# EasyEDA schematic 1-Schematic_TW4 Main board2.json
TITLE: Sheet_1; REV: 1.0; Date: 2025-03-01; Sheet: 1/1; Drawn By: anthony.a.douglas; Company: Your Company
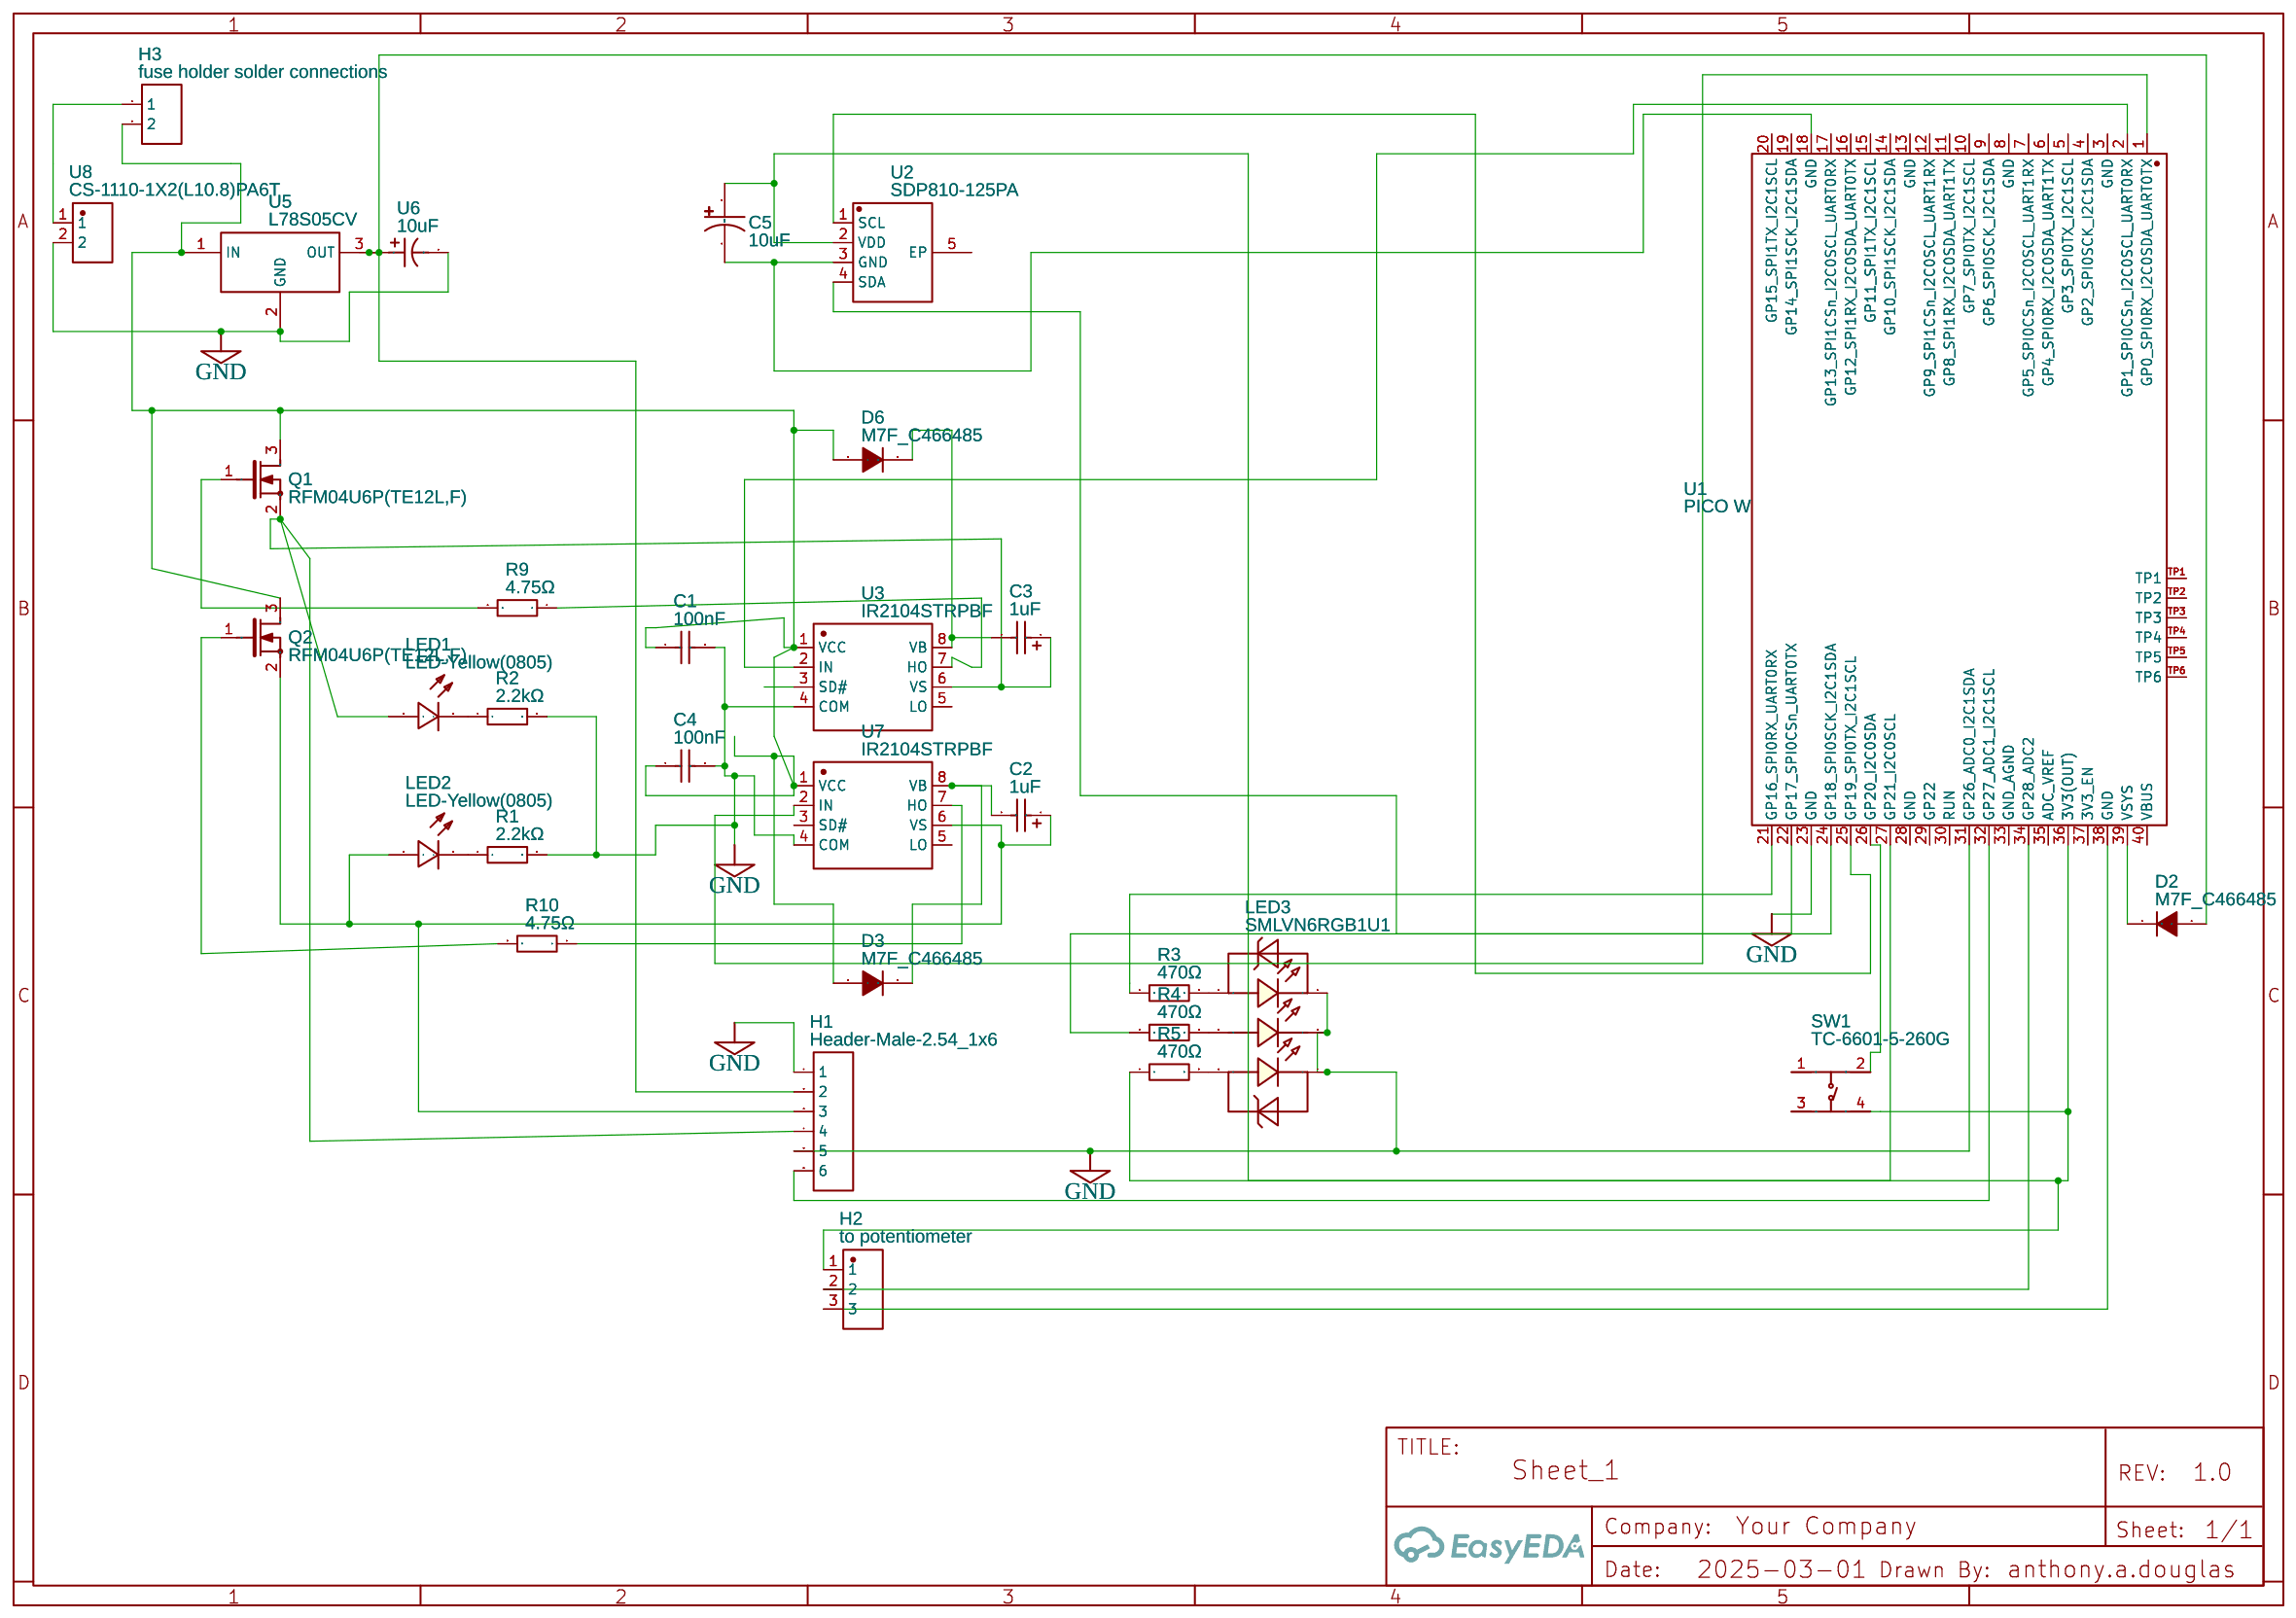
[diagram p0: schematic sheet]

## Parts
C1  100nF  [C0603]
C2  1uF  [CASE-A_3216]
C3  1uF  [CASE-A_3216]
C4  100nF  [C0603]
C5  10uF  [CAP-SMD_BD5.0-L5.3-W5.3-FD]
D2  M7F_C466485  [SMAF_L3.5-W2.6-LS4.7-RD]
D3  M7F_C466485  [SMAF_L3.5-W2.6-LS4.7-RD]
D6  M7F_C466485  [SMAF_L3.5-W2.6-LS4.7-RD]
H1  Header-Male-2.54_1x6  [HDR-TH_6P-P2.54-V-M-1]
H2  to potentiometer  [HDR-TH_3P-P2.54_HC-PM254-8.5H-1X3PW]
H3  fuse holder solder connections  [HDR-F-2.54_1X2]
LED1  LED-Yellow(0805)  [LED-0805]
LED2  LED-Yellow(0805)  [LED-0805]
LED3  SMLVN6RGB1U1  [LED-SMD_6P-L3.1-W2.8-BR_SMLVN6RGB]
Q1  RFM04U6P(TE12L,F)  [SC-62-3_L4.6-W2.5-P1.50-LS4.2-BR]
Q2  RFM04U6P(TE12L,F)  [SC-62-3_L4.6-W2.5-P1.50-LS4.2-BR]
R1  2.2kΩ  [R0603]
R2  2.2kΩ  [R0603]
R3  470Ω  [R1206]
R4  470Ω  [R1206]
R5  470Ω  [R1206]
R9  4.75Ω  [R0402]
R10  4.75Ω  [R0402]
SW1  TC-6601-5-260G  [KEY-SMD_4P-L6.0-W6.0-P4.50-LS10.0]
U1  PICO W  [COMM-SMD_L51.0-W21.0-P2.54_PICOW]
U2  SDP810-125PA  [SENSOR-TH_SDP810-125PA]
U3  IR2104STRPBF  [SOIC-8_L4.9-W3.9-P1.27-LS6.0-BL]
U5  L78S05CV  [TO-220-3_L10.0-W4.5-P2.54-L]
U6  10uF  [CAP-SMD_L2.0-W1.3-FD]
U7  IR2104STRPBF  [SOIC-8_L4.9-W3.9-P1.27-LS6.0-BL]
U8  CS-1110-1X2(L10.8)PA6T  [CONN-TH_CS-1110-1X2-PA6T]

## Library data of the parts
C1 C4 = CGA3E2X7R1H104KT0Y0N: Supplier: LCSC; Manufacturer: TDK; Supplier Part: C76711; JLCPCB Part Class: Extended Part
C2 C3 = TAJA105K035RNJ: Supplier: LCSC; Manufacturer: Kyocera AVX; Supplier Part: C7176; JLCPCB Part Class: Extended Part
C5 = EEEFK1V100AR: Contributor: LCSC; Supplier: LCSC; Supplier Part: C264057; Manufacturer: PANASONIC(松下); JLCPCB Part Class: Extended Part
D2 D3 D6 = M7F_C466485: Contributor: LCSC; Supplier: LCSC; Supplier Part: C466485; Manufacturer: High Diode(海德); Manufacturer Part: M7F; JLCPCB Part Class: Extended Part
H1 = Header-Male-2.54_1x6: Supplier: LCSC; Manufacturer: BOOMELE(博穆精密); Manufacturer Part: 2.54-1x6P直针; Supplier Part: C37208; JLCPCB Part Class: Extended Part
H2 = HC-PM254-8.5H-1X3PW: Supplier: LCSC; Supplier Part: C22373927; Manufacturer: HC(虹成电子); Manufacturer Part: HC-PM254-8.5H-1x3PW-02A; JLCPCB Part Class: Extended Part; Contributor: lcsc
H3 = HDR-F-2.54_1x2: Supplier Part: C49661; Supplier: LCSC; Contributor: LCEDA_Lib
LED1 LED2 = LED-Yellow(0805): Supplier: LCSC; Manufacturer: Hubei KENTO Elec; Manufacturer Part: 17-21SUYC/TR8; Supplier Part: C2296
LED3 = SMLVN6RGB1U1: Contributor: LCSC; Supplier: LCSC; Supplier Part: C2909770; Manufacturer: ROHM(罗姆); JLCPCB Part Class: Extended Part
Q1 Q2 = RFM04U6P(TE12L,F): Contributor: LCSC; Supplier: LCSC; Supplier Part: C194959; Manufacturer: TOSHIBA(东芝); JLCPCB Part Class: Extended Part
R1 R2 = 0603WAF2201T5E: Supplier: LCSC; Manufacturer: UNI-ROYAL(厚声); Supplier Part: C4190; JLCPCB Part Class: Basic Part
R3-R5 = 1206W4F4700T5E: Supplier: LCSC; Manufacturer: UNI-ROYAL(厚声); Supplier Part: C4502; JLCPCB Part Class: Extended Part
R9 R10 = RTT024R75FTH: Contributor: LCSC; Supplier: LCSC; Manufacturer: RALEC(旺诠); Supplier Part: C159019; JLCPCB Part Class: Extended Part
SW1 = TC-6601-5-260G: Contributor: LCSC; Supplier: LCSC; Supplier Part: C2845298; Manufacturer: HCTL(华灿天禄); JLCPCB Part Class: Extended Part
U1 = PICO W: Supplier: LCSC; Supplier Part: C7203003; Manufacturer: Raspberry Pi(树莓派); Contributor: lcsc; JLCPCB Part Class: Extended Part
U2 = SDP810-125PA: Contributor: LCSC; Supplier: LCSC; Manufacturer: Sensirion(瑞士盛思锐); Manufacturer Part: SDP810-125PA-D; Supplier Part: C153055; JLCPCB Part Class: Extended Part
U3 U7 = IR2104STRPBF: Supplier: LCSC; Manufacturer: Infineon(英飞凌); Supplier Part: C2960; JLCPCB Part Class: Extended Part
U5 = L78S05CV: Supplier: LCSC; Manufacturer: ST(意法半导体); Supplier Part: C33043; JLCPCB Part Class: Extended Part
U6 = TMCP1A106MTRF: Supplier: LCSC; Supplier Part: C1969735; Manufacturer: VISHAY(威世); JLCPCB Part Class: Extended Part; Contributor: lcsc
U8 = CS-1110-1X2(L10.8)PA6T: Supplier: LCSC; Supplier Part: C18213725; Manufacturer: CST(永丰盈); Contributor: lcsc; JLCPCB Part Class: Extended Part

## Nets
GND: C1.2 C4.2 H1.1 H1.5 LED3.4(-) LED3.5(-) LED3.6(-) R1.2 R2.2 U1.23(GND) U1.31(GP26_ADC0_I2C1SDA) U3.4(COM) U5.2(GND) U6.2 U7.4(COM) U8.2
Net-(C1-1): C1.1 C4.1 D3.2(A) D6.2(A) H3.2 Q1.3(D) Q2.3(D) U3.1(VCC) U5.1(IN) U7.1(VCC)
Net-(C2-1): C2.1 H1.3 LED2.1(+) Q2.2(S) U7.6(VS)
Net-(C2-2): C2.2 D3.1(C) U7.8(VB)
Net-(C3-1): C3.1 H1.4 LED1.1(+) Q1.2(S) U3.6(VS)
Net-(C3-2): C3.2 D6.1(C) U3.8(VB)
Net-(C5-1): C5.1 H2.1 SW1.4 U1.36(3V3(OUT)) U2.2(VDD)
Net-(C5-2): C5.2 U1.18(GND) U2.3(GND)
Net-(D2-1): D2.1(C) U1.39(VSYS)
Net-(D2-2): D2.2(A) H1.2 U5.3(OUT) U6.1
Net-(H1-6): H1.6 U1.32(GP27_ADC1_I2C1SCL)
Net-(H2-2): H2.2 U1.34(GP28_ADC2)
Net-(H2-3): H2.3 U1.38(GND)
Net-(H3-1): H3.1 U8.1
Net-(LED1-2): LED1.2(-) R2.1
Net-(LED2-2): LED2.2(-) R1.1
Net-(LED3-1): LED3.1(+) R3.2
Net-(LED3-2): LED3.2(+) R4.2
Net-(LED3-3): LED3.3(+) R5.2
Net-(Q1-1): Q1.1(G) R9.2
Net-(Q2-1): Q2.1(G) R10.2
Net-(R3-1): R3.1 U1.21(GP16_SPI0RX_UART0RX)
Net-(R4-1): R4.1 U1.22(GP17_SPI0CSn_UART0TX)
Net-(R5-1): R5.1 U1.27(GP21_I2C0SCL)
Net-(R9-1): R9.1 U3.7(HO)
Net-(R10-1): R10.1 U7.7(HO)
Net-(SW1-2): SW1.2 U1.26(GP20_I2C0SDA)
Net-(U1-1): U1.1(GP0_SPI0RX_I2C0SDA_UART0TX) U7.2(IN)
Net-(U1-2): U1.2(GP1_SPI0CSn_I2C0SCL_UART0RX) U3.2(IN)
Net-(U1-24): U1.24(GP18_SPI0SCK_I2C1SDA) U2.4(SDA)
Net-(U1-25): U1.25(GP19_SPI0TX_I2C1SCL) U2.1(SCL)

Not connected (* = marked no-connect by the designer): SW1 1 3; U1 3(GND) 4(GP2_SPI0SCK_I2C1SDA) 5(GP3_SPI0TX_I2C1SCL) 6(GP4_SPI0RX_I2C0SDA_UART1TX) 7(GP5_SPI0CSn_I2C0SCL_UART1RX) 8(GND) 9(GP6_SPI0SCK_I2C1SDA) 10(GP7_SPI0TX_I2C1SCL) 11(GP8_SPI1RX_I2C0SDA_UART1TX) 12(GP9_SPI1CSn_I2C0SCL_UART1RX) 13(GND) 14(GP10_SPI1SCK_I2C1SDA) 15(GP11_SPI1TX_I2C1SCL) 16(GP12_SPI1RX_I2C0SDA_UART0TX) 17(GP13_SPI1CSn_I2C0SCL_UART0RX) 19(GP14_SPI1SCK_I2C1SDA) 20(GP15_SPI1TX_I2C1SCL) 28(GND) 29(GP22) 30(RUN) 33(GND_AGND) 35(ADC_VREF) 37(3V3_EN) 40(VBUS) TP1 TP2 TP3 TP4 TP5 TP6; U2 5(EP); U3 3(SD#) 5(LO); U7 3(SD#) 5(LO)
